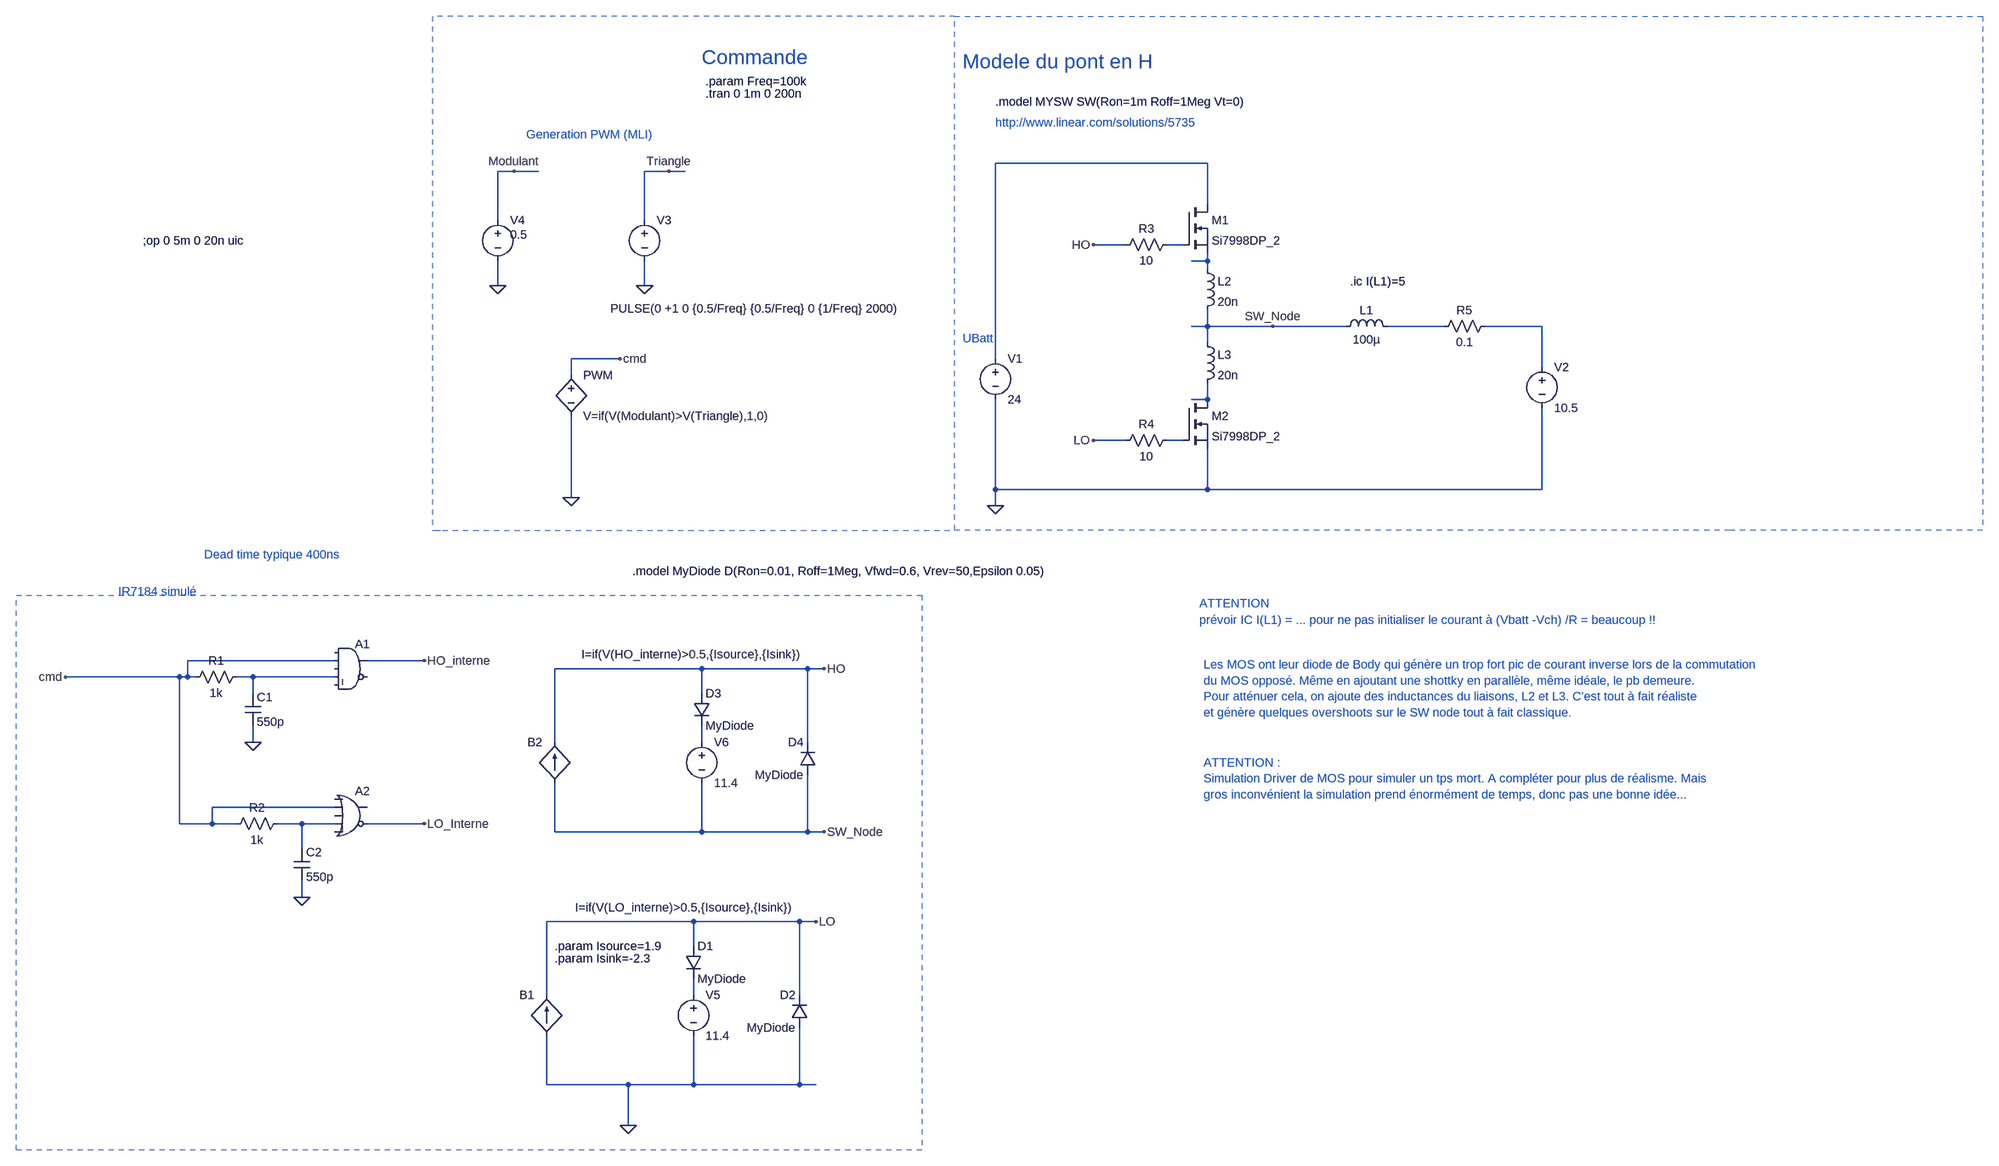
[diagram p0: schematic CelluleCommut.asc]
CelluleCommut.asc, the LTspice schematic file:
Version 4
SHEET 1 8532 1444
WIRE 7008 -496 6592 -496
WIRE 5648 -480 5616 -480
WIRE 5696 -480 5648 -480
WIRE 5952 -480 5904 -480
WIRE 5984 -480 5952 -480
WIRE 7008 -416 7008 -496
WIRE 5616 -384 5616 -480
WIRE 5904 -384 5904 -480
WIRE 6848 -336 6784 -336
WIRE 6960 -336 6928 -336
WIRE 7008 -304 7008 -320
WIRE 7008 -304 6976 -304
WIRE 7008 -288 7008 -304
WIRE 5616 -256 5616 -304
WIRE 5904 -256 5904 -304
WIRE 7008 -176 7008 -208
WIRE 7008 -176 6976 -176
WIRE 7136 -176 7008 -176
WIRE 7280 -176 7136 -176
WIRE 7472 -176 7360 -176
WIRE 7664 -176 7552 -176
WIRE 7008 -144 7008 -176
WIRE 5856 -112 5760 -112
WIRE 6592 -112 6592 -496
WIRE 7664 -96 7664 -176
WIRE 5760 -80 5760 -112
WIRE 7008 -32 7008 -64
WIRE 7008 -32 6976 -32
WIRE 6848 48 6784 48
WIRE 6960 48 6928 48
WIRE 6592 144 6592 -32
WIRE 7008 144 7008 64
WIRE 7008 144 6592 144
WIRE 7664 144 7664 -16
WIRE 7664 144 7008 144
WIRE 5760 160 5760 0
WIRE 6592 176 6592 144
WIRE 5296 480 5008 480
WIRE 5472 480 5360 480
WIRE 6016 496 5728 496
WIRE 6224 496 6016 496
WIRE 6256 496 6224 496
WIRE 4992 512 4768 512
WIRE 5008 512 5008 480
WIRE 5008 512 4992 512
WIRE 5024 512 5008 512
WIRE 5136 512 5104 512
WIRE 5296 512 5136 512
WIRE 5136 544 5136 512
WIRE 6016 544 6016 496
WIRE 5136 640 5136 608
WIRE 5728 640 5728 496
WIRE 6016 640 6016 608
WIRE 6224 640 6224 496
WIRE 5296 768 5056 768
WIRE 4992 800 4992 512
WIRE 5056 800 5056 768
WIRE 5056 800 4992 800
WIRE 5104 800 5056 800
WIRE 5232 800 5184 800
WIRE 5296 800 5232 800
WIRE 5472 800 5360 800
WIRE 5728 816 5728 720
WIRE 6016 816 6016 720
WIRE 6016 816 5728 816
WIRE 6224 816 6224 704
WIRE 6224 816 6016 816
WIRE 6256 816 6224 816
WIRE 5232 848 5232 800
WIRE 5232 944 5232 912
WIRE 6000 992 5712 992
WIRE 6208 992 6000 992
WIRE 6240 992 6208 992
WIRE 6000 1040 6000 992
WIRE 5712 1136 5712 992
WIRE 6000 1136 6000 1104
WIRE 6208 1136 6208 992
WIRE 5712 1312 5712 1216
WIRE 5872 1312 5712 1312
WIRE 6000 1312 6000 1216
WIRE 6000 1312 5872 1312
WIRE 6208 1312 6208 1200
WIRE 6208 1312 6000 1312
WIRE 6240 1312 6208 1312
WIRE 5872 1392 5872 1312
FLAG 6592 176 0
FLAG 5648 -480 Modulant
FLAG 5904 -256 0
FLAG 5616 -256 0
FLAG 5952 -480 Triangle
FLAG 5760 160 0
FLAG 5856 -112 cmd
FLAG 5136 640 0
FLAG 4768 512 cmd
FLAG 5472 480 HO_interne
FLAG 5232 944 0
FLAG 5472 800 LO_Interne
FLAG 6784 -336 HO
FLAG 6784 48 LO
FLAG 7136 -176 SW_Node
FLAG 5872 1392 0
FLAG 6240 992 LO
FLAG 6256 496 HO
FLAG 6256 816 SW_Node
SYMBOL voltage 6592 -128 R0
WINDOW 123 0 0 Left 2
WINDOW 39 0 0 Left 2
SYMATTR InstName V1
SYMATTR Value 24
SYMBOL voltage 5904 -400 R0
WINDOW 123 0 0 Left 2
WINDOW 39 0 0 Left 2
WINDOW 3 -67 189 Left 2
SYMATTR Value PULSE(0 +1 0 {0.5/Freq} {0.5/Freq} 0 {1/Freq} 2000)
SYMATTR InstName V3
SYMBOL voltage 5616 -400 R0
WINDOW 123 0 0 Left 2
WINDOW 39 0 0 Left 2
WINDOW 3 24 44 Left 2
SYMATTR Value 0.5
SYMATTR InstName V4
SYMBOL bv 5760 -96 R0
SYMATTR InstName PWM
SYMATTR Value V=if(V(Modulant)>V(Triangle),1,0)
SYMBOL nmos 6960 -416 R0
SYMATTR InstName M1
SYMATTR Value Si7998DP_2
SYMBOL Digital\\and 5328 432 R0
SYMATTR InstName A1
SYMBOL res 5120 496 R90
WINDOW 0 0 56 VBottom 2
WINDOW 3 32 56 VTop 2
SYMATTR InstName R1
SYMATTR Value 1k
SYMBOL cap 5120 544 R0
SYMATTR InstName C1
SYMATTR Value 550p
SYMBOL Digital\\or 5328 720 R0
SYMATTR InstName A2
SYMBOL cap 5216 848 R0
SYMATTR InstName C2
SYMATTR Value 550p
SYMBOL res 5200 784 R90
WINDOW 0 0 56 VBottom 2
WINDOW 3 32 56 VTop 2
SYMATTR InstName R2
SYMATTR Value 1k
SYMBOL res 6944 -352 R90
WINDOW 0 0 56 VBottom 2
WINDOW 3 32 56 VTop 2
SYMATTR InstName R3
SYMATTR Value 10
SYMBOL res 6944 32 R90
WINDOW 0 0 56 VBottom 2
WINDOW 3 32 56 VTop 2
SYMATTR InstName R4
SYMATTR Value 10
SYMBOL ind 7264 -160 R270
WINDOW 0 32 56 VTop 2
WINDOW 3 5 56 VBottom 2
SYMATTR InstName L1
SYMATTR Value 100µ
SYMBOL res 7568 -192 R90
WINDOW 0 0 56 VBottom 2
WINDOW 3 32 56 VTop 2
SYMATTR InstName R5
SYMATTR Value 0.1
SYMBOL voltage 7664 -112 R0
WINDOW 123 0 0 Left 2
WINDOW 39 0 0 Left 2
SYMATTR InstName V2
SYMATTR Value 10.5
SYMBOL nmos 6960 -32 R0
SYMATTR InstName M2
SYMATTR Value Si7998DP_2
SYMBOL ind 6992 -304 R0
SYMATTR InstName L2
SYMATTR Value 20n
SYMBOL ind 6992 -160 R0
SYMATTR InstName L3
SYMATTR Value 20n
SYMBOL bi 5712 1216 R180
WINDOW 0 24 80 Left 2
WINDOW 3 -481 252 Left 2
SYMATTR InstName B1
SYMATTR Value I=if(V(LO_interne)>0.5,{Isource},{Isink})
SYMBOL voltage 6000 1120 R0
WINDOW 123 0 0 Left 2
WINDOW 39 0 0 Left 2
SYMATTR InstName V5
SYMATTR Value 11.4
SYMBOL diode 5984 1040 R0
SYMATTR InstName D1
SYMATTR Value MyDiode
SYMBOL diode 6224 1200 R180
WINDOW 0 24 64 Left 2
WINDOW 3 24 0 Left 2
SYMATTR InstName D2
SYMATTR Value MyDiode
SYMBOL bi 5728 720 R180
WINDOW 0 24 80 Left 2
WINDOW 3 -481 252 Left 2
SYMATTR InstName B2
SYMATTR Value I=if(V(HO_interne)>0.5,{Isource},{Isink})
SYMBOL voltage 6016 624 R0
WINDOW 123 0 0 Left 2
WINDOW 39 0 0 Left 2
SYMATTR InstName V6
SYMATTR Value 11.4
SYMBOL diode 6000 544 R0
SYMATTR InstName D3
SYMATTR Value MyDiode
SYMBOL diode 6240 704 R180
WINDOW 0 24 64 Left 2
WINDOW 3 24 0 Left 2
SYMATTR InstName D4
SYMATTR Value MyDiode
TEXT 6592 -616 Left 2 !.model MYSW SW(Ron=1m Roff=1Meg Vt=0)
TEXT 6024 -632 Left 2 !.tran 0 1m 0 200n
TEXT 6592 -576 Left 2 ;http://www.linear.com/solutions/5735
TEXT 6528 -696 Left 4 ;Modele du pont en H
TEXT 6016 -704 Left 4 ;Commande
TEXT 6024 -656 Left 2 !.param Freq=100k
TEXT 6528 -152 Left 2 ;UBatt
TEXT 5672 -552 Left 2 ;Generation PWM (MLI)
TEXT 4872 344 Left 2 ;IR7184 simulé
TEXT 5040 272 Left 2 ;Dead time typique 400ns
TEXT 4920 -344 Left 2 !;op 0 5m 0 20n uic
TEXT 7288 -264 Left 2 !.ic I(L1)=5
TEXT 6992 400 Left 2 ;prévoir IC I(L1) = ... pour ne pas initialiser le courant à (Vbatt -Vch) /R = beaucoup !!
TEXT 6992 368 Left 2 ;ATTENTION
TEXT 7000 488 Left 2 ;Les MOS ont leur diode de Body qui génère un trop fort pic de courant inverse lors de la commutation\ndu MOS opposé. Même en ajoutant une shottky en parallèle, même idéale, le pb demeure.\nPour atténuer cela, on ajoute des inductances du liaisons, L2 et L3. C'est tout à fait réaliste\net génère quelques overshoots sur le SW node tout à fait classique.
TEXT 7000 680 Left 2 ;ATTENTION :\nSimulation Driver de MOS pour simuler un tps mort. A compléter pour plus de réalisme. Mais \ngros inconvénient la simulation prend énormément de temps, donc pas une bonne idée...
TEXT 5728 1040 Left 2 !.param Isource=1.9
TEXT 5728 1064 Left 2 !.param Isink=-2.3
TEXT 5880 304 Left 2 !.model MyDiode D(Ron=0.01, Roff=1Meg, Vfwd=0.6, Vrev=50,Epsilon 0.05)
LINE Normal 6512 -784 8032 -784 2
LINE Normal 8032 224 6512 224 2
LINE Normal 8528 224 8032 224 2
LINE Normal 8528 -784 8528 224 2
LINE Normal 8032 -784 8528 -784 2
LINE Normal 5488 -784 5488 -784 2
LINE Normal 5488 224 5504 224 2
RECTANGLE Normal 5488 224 6512 -784 2
RECTANGLE Normal 6448 1440 4672 352 2

The netlist it stands for:
* CelluleCommut.asc
V1 N001 0 24
V3 Triangle 0 PULSE(0 +1 0 {0.5/Freq} {0.5/Freq} 0 {1/Freq} 2000)
V4 Modulant 0 0.5
B§PWM cmd 0 V=if(V(Modulant)>V(Triangle),1,0)
M1 N001 N002 N003 N003 Si7998DP_2
A1 0 cmd 0 N008 0 0 HO_interne 0 AND
R1 N008 cmd 1k
C1 N008 0 550p
A2 0 cmd 0 N010 0 LO_Interne 0 0 OR
C2 N010 0 550p
R2 N010 cmd 1k
R3 N002 HO 10
R4 N007 LO 10
L1 SW_Node N004 100µ
R5 N005 N004 0.1
V2 N005 0 10.5
M2 N006 N007 0 0 Si7998DP_2
L2 N003 SW_Node 20n
L3 SW_Node N006 20n
B1 0 LO I=if(V(LO_interne)>0.5,{Isource},{Isink})
V5 N011 0 11.4
D1 LO N011 MyDiode
D2 0 LO MyDiode
B2 SW_Node HO I=if(V(HO_interne)>0.5,{Isource},{Isink})
V6 N009 SW_Node 11.4
D3 HO N009 MyDiode
D4 SW_Node HO MyDiode
.model D D
.lib standard.dio
.model NMOS NMOS
.model PMOS PMOS
.lib standard.mos
.model MYSW SW(Ron=1m Roff=1Meg Vt=0)
.tran 0 1m 0 200n
* http://www.linear.com/solutions/5735
* Modele du pont en H
* Commande
.param Freq=100k
* UBatt
* Generation PWM (MLI)
* IR7184 simulé
* Dead time typique 400ns
;op 0 5m 0 20n uic
.ic I(L1)=5
* prévoir IC I(L1) = ... pour ne pas initialiser le courant à (Vbatt -Vch) /R = beaucoup !!
* ATTENTION
* Les MOS ont leur diode de Body qui génère un trop fort pic de courant inverse lors de la commutation
* du MOS opposé. Même en ajoutant une shottky en parallèle, même idéale, le pb demeure.
* Pour atténuer cela, on ajoute des inductances du liaisons, L2 et L3. C'est tout à fait réaliste
* et génère quelques overshoots sur le SW node tout à fait classique.
* ATTENTION :
* Simulation Driver de MOS pour simuler un tps mort. A compléter pour plus de réalisme. Mais
* gros inconvénient la simulation prend énormément de temps, donc pas une bonne idée...
.param Isource=1.9
.param Isink=-2.3
.model MyDiode D(Ron=0.01, Roff=1Meg, Vfwd=0.6, Vrev=50,Epsilon 0.05)
.backanno
.end